# Altium schematic sheet data_logger.SchDoc
size A2; SheetNumber: 1; SheetTotal: 12
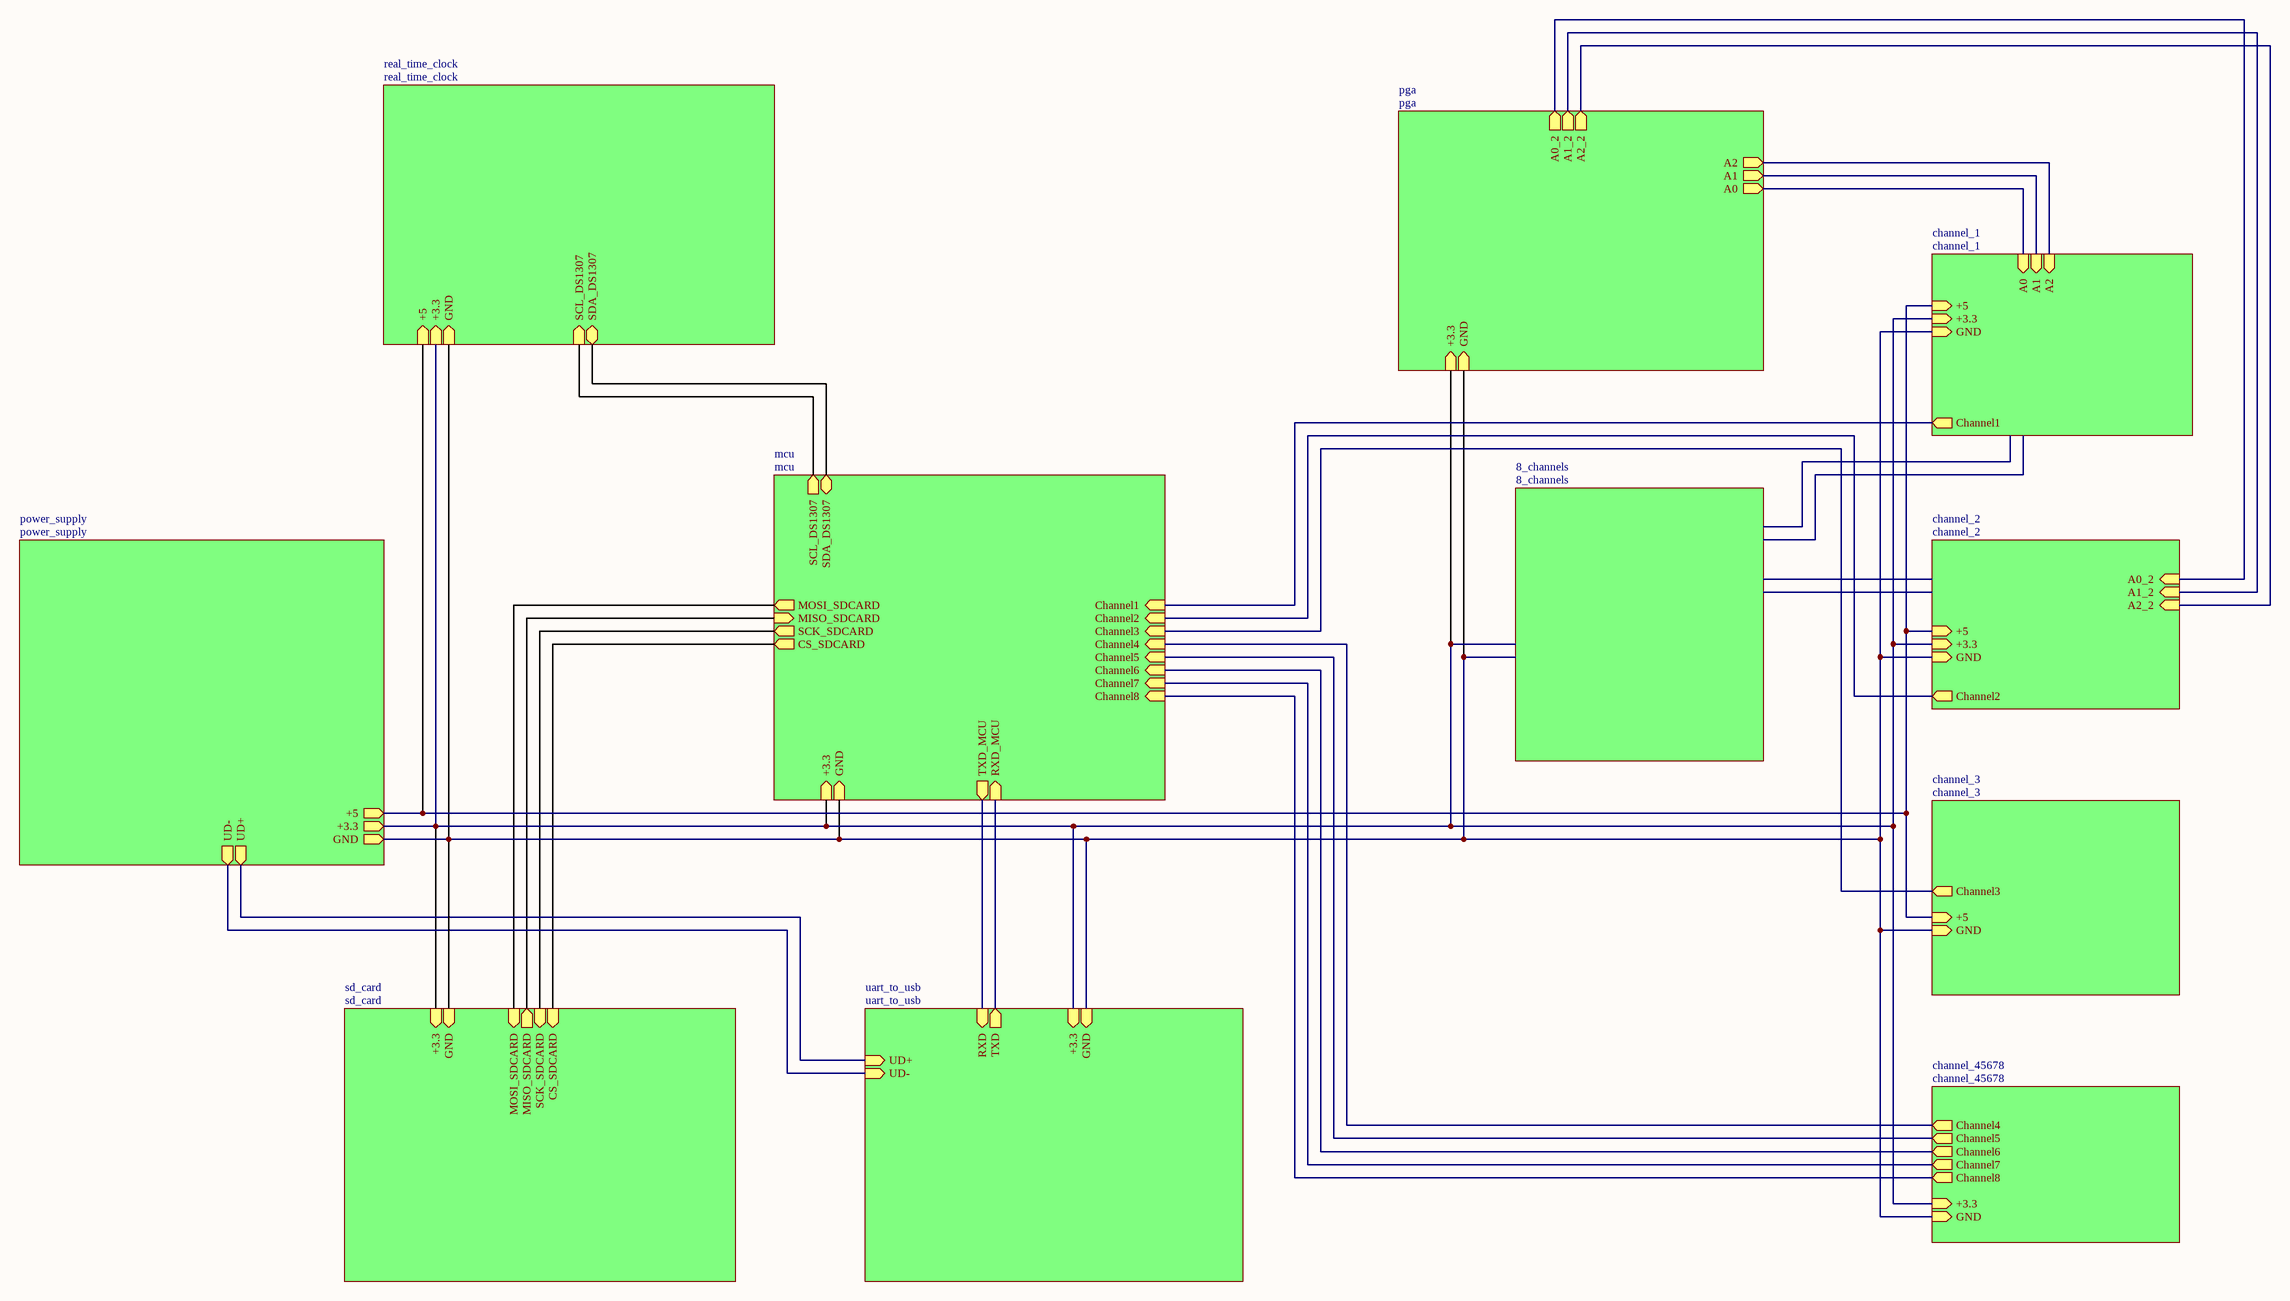
[diagram p0: data_logger.SchDoc]

## Sub-sheets
8_channels = 8_channels: no entries
channel_1 = channel_1: A2 (in), GND (in), Channel1 (out), +3.3 (in), A0 (in), A1 (in), +5 (in)
channel_2 = channel_2: GND (in), Channel2 (out), A2_2 (in), A1_2 (in), A0_2 (in), +3.3 (in), +5 (in)
channel_3 = channel_3: Channel3 (out), GND (in), +5 (in)
channel_45678 = channel_45678: Channel4 (out), Channel8 (out), Channel5 (out), Channel6 (out), Channel7 (out), GND (in), +3.3 (in)
mcu = mcu: Channel3 (in), MOSI_SDCARD (out), CS_SDCARD (out), GND (in), Channel7 (in), Channel6 (in), Channel1 (in), Channel4 (in), Channel2 (in), SCL_DS1307 (out), Channel5 (in), SCK_SDCARD (out), MISO_SDCARD (in), SDA_DS1307 (bidir), Channel8 (in), +3.3 (in), TXD_MCU (out), RXD_MCU (in)
pga = pga: GND (in), +3.3 (in), A2 (out), A0 (out), A1 (out), A0_2 (out), A1_2 (out), A2_2 (out)
power_supply = power_supply: GND (out), +3.3 (out), +5 (out), UD- (out), UD+ (out)
real_time_clock = real_time_clock: GND (in), +5 (in), SCL_DS1307 (in), SDA_DS1307 (bidir), +3.3 (in)
sd_card = sd_card: MISO_SDCARD (out), CS_SDCARD (in), SCK_SDCARD (in), GND (in), MOSI_SDCARD (in), +3.3 (in)
uart_to_usb = uart_to_usb: GND (in), +3.3 (in), RXD (in), TXD (out), UD+ (in), UD- (in)

## Nets
(unnamed): sheet power_supply/GND, sheet real_time_clock/GND, sheet pga/GND, sheet sd_card/GND, sheet uart_to_usb/GND, sheet mcu/GND, sheet channel_1/GND, sheet channel_2/GND, sheet channel_3/GND, sheet channel_45678/GND
(unnamed): sheet power_supply/+3.3, sheet real_time_clock/+3.3, sheet pga/+3.3, sheet sd_card/+3.3, sheet uart_to_usb/+3.3, sheet mcu/+3.3, sheet channel_1/+3.3, sheet channel_2/+3.3, sheet channel_45678/+3.3
(unnamed): sheet power_supply/+5, sheet real_time_clock/+5, sheet channel_1/+5, sheet channel_2/+5, sheet channel_3/+5
(unnamed): sheet power_supply/UD-, sheet uart_to_usb/UD-
(unnamed): sheet power_supply/UD+, sheet uart_to_usb/UD+
(unnamed): sheet real_time_clock/SCL_DS1307, sheet mcu/SCL_DS1307
(unnamed): sheet real_time_clock/SDA_DS1307, sheet mcu/SDA_DS1307
(unnamed): sheet pga/A2, sheet channel_1/A2
(unnamed): sheet pga/A0, sheet channel_1/A0
(unnamed): sheet pga/A1, sheet channel_1/A1
(unnamed): sheet pga/A0_2, sheet channel_2/A0_2
(unnamed): sheet pga/A1_2, sheet channel_2/A1_2
(unnamed): sheet pga/A2_2, sheet channel_2/A2_2
(unnamed): sheet sd_card/MISO_SDCARD, sheet mcu/MISO_SDCARD
(unnamed): sheet sd_card/CS_SDCARD, sheet mcu/CS_SDCARD
(unnamed): sheet sd_card/SCK_SDCARD, sheet mcu/SCK_SDCARD
(unnamed): sheet sd_card/MOSI_SDCARD, sheet mcu/MOSI_SDCARD
(unnamed): sheet uart_to_usb/RXD, sheet mcu/TXD_MCU
(unnamed): sheet uart_to_usb/TXD, sheet mcu/RXD_MCU
(unnamed): sheet mcu/Channel3, sheet channel_3/Channel3
(unnamed): sheet mcu/Channel7, sheet channel_45678/Channel7
(unnamed): sheet mcu/Channel6, sheet channel_45678/Channel6
(unnamed): sheet mcu/Channel1, sheet channel_1/Channel1
(unnamed): sheet mcu/Channel4, sheet channel_45678/Channel4
(unnamed): sheet mcu/Channel2, sheet channel_2/Channel2
(unnamed): sheet mcu/Channel5, sheet channel_45678/Channel5
(unnamed): sheet mcu/Channel8, sheet channel_45678/Channel8